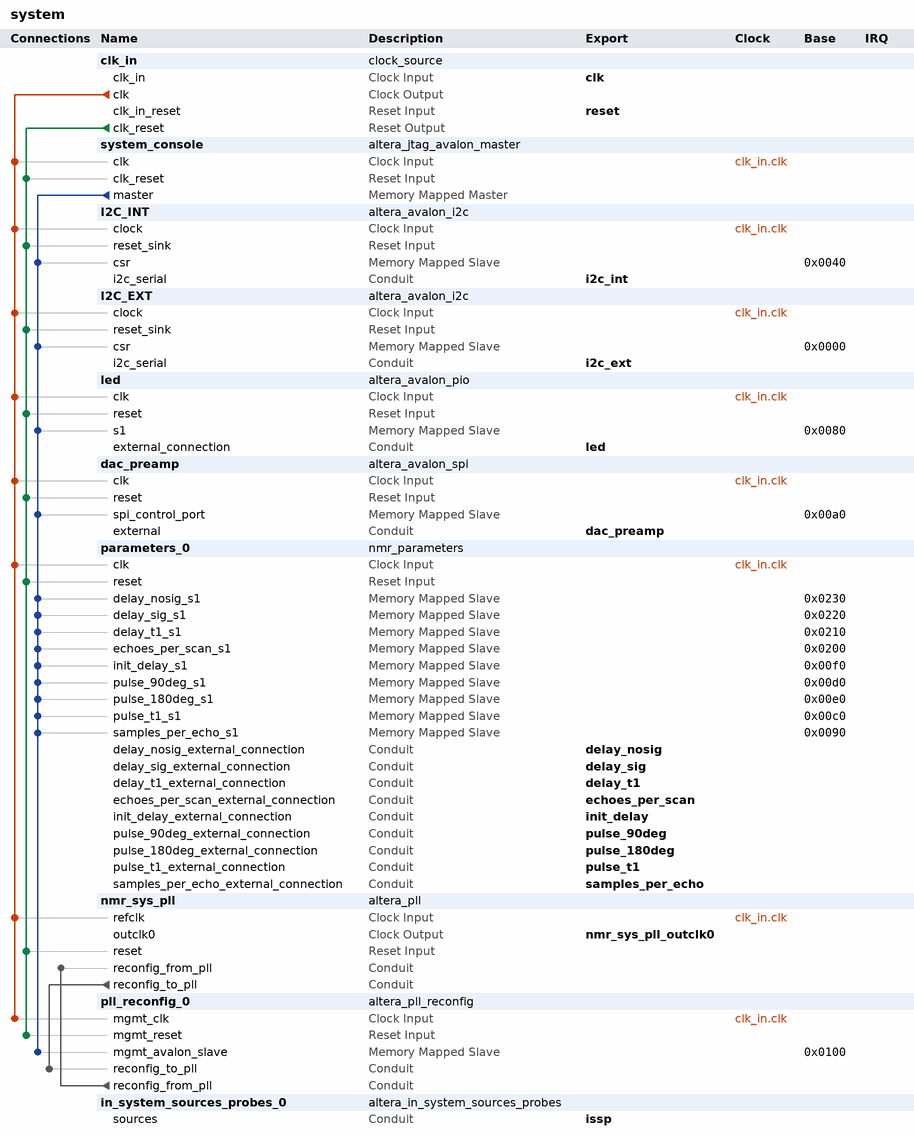
[diagram p0: system contents]
# Platform Designer (Qsys) system system, Cyclone V 5CSEMA5F31C6
# Parameters at their usual value, and those the tool derives, are not listed.
package require -exact qsys 17.1
create_system system
set_project_property DEVICE_FAMILY {Cyclone V}
set_project_property DEVICE 5CSEMA5F31C6

add_instance clk_in clock_source 17.1
set_instance_parameter_value clk_in clockFrequency 50000000

add_instance system_console altera_jtag_avalon_master 17.1

add_instance I2C_INT altera_avalon_i2c 17.1
set_instance_parameter_value I2C_INT FIFO_DEPTH 16

add_instance I2C_EXT altera_avalon_i2c 17.1
set_instance_parameter_value I2C_EXT FIFO_DEPTH 16

add_instance led altera_avalon_pio 17.1
set_instance_parameter_value led direction Output
set_instance_parameter_value led width 10

add_instance dac_preamp altera_avalon_spi 17.1
set_instance_parameter_value dac_preamp clockPolarity 1
set_instance_parameter_value dac_preamp dataWidth 24
set_instance_parameter_value dac_preamp masterSPI true
set_instance_parameter_value dac_preamp numberOfSlaves 1
set_instance_parameter_value dac_preamp targetClockRate 128000

add_instance parameters_0 nmr_parameters 1.0

add_instance nmr_sys_pll altera_pll 17.1
set_instance_parameter_value nmr_sys_pll gui_device_speed_grade 1
set_instance_parameter_value nmr_sys_pll gui_en_reconf true
set_instance_parameter_value nmr_sys_pll gui_number_of_clocks 1
set_instance_parameter_value nmr_sys_pll gui_operation_mode direct
set_instance_parameter_value nmr_sys_pll gui_output_clock_frequency0 68.8
set_instance_parameter_value nmr_sys_pll gui_pll_mode {Fractional-N PLL}
set_instance_parameter_value nmr_sys_pll gui_reference_clock_frequency 50.0
set_instance_parameter_value nmr_sys_pll gui_use_locked false

add_instance pll_reconfig_0 altera_pll_reconfig 17.1

add_instance in_system_sources_probes_0 altera_in_system_sources_probes 17.1
set_instance_parameter_value in_system_sources_probes_0 create_source_clock false
set_instance_parameter_value in_system_sources_probes_0 instance_id NONE
set_instance_parameter_value in_system_sources_probes_0 probe_width 0
set_instance_parameter_value in_system_sources_probes_0 source_width 1

# connections
add_connection clk_in.clk dac_preamp.clk clock
add_connection clk_in.clk I2C_EXT.clock clock
add_connection clk_in.clk I2C_INT.clock clock
add_connection clk_in.clk led.clk clock
add_connection clk_in.clk nmr_sys_pll.refclk clock
add_connection clk_in.clk parameters_0.clk clock
add_connection clk_in.clk pll_reconfig_0.mgmt_clk clock
add_connection clk_in.clk system_console.clk clock
add_connection clk_in.clk_reset dac_preamp.reset reset
add_connection clk_in.clk_reset I2C_EXT.reset_sink reset
add_connection clk_in.clk_reset I2C_INT.reset_sink reset
add_connection clk_in.clk_reset led.reset reset
add_connection clk_in.clk_reset nmr_sys_pll.reset reset
add_connection clk_in.clk_reset parameters_0.reset reset
add_connection clk_in.clk_reset pll_reconfig_0.mgmt_reset reset
add_connection clk_in.clk_reset system_console.clk_reset reset
add_connection system_console.master dac_preamp.spi_control_port avalon
set_connection_parameter_value system_console.master/dac_preamp.spi_control_port baseAddress 0x00a0
add_connection system_console.master I2C_EXT.csr avalon
set_connection_parameter_value system_console.master/I2C_EXT.csr baseAddress 0x0000
add_connection system_console.master I2C_INT.csr avalon
set_connection_parameter_value system_console.master/I2C_INT.csr baseAddress 0x0040
add_connection system_console.master led.s1 avalon
set_connection_parameter_value system_console.master/led.s1 baseAddress 0x0080
add_connection system_console.master parameters_0.delay_nosig_s1 avalon
set_connection_parameter_value system_console.master/parameters_0.delay_nosig_s1 baseAddress 0x0230
add_connection system_console.master parameters_0.delay_sig_s1 avalon
set_connection_parameter_value system_console.master/parameters_0.delay_sig_s1 baseAddress 0x0220
add_connection system_console.master parameters_0.delay_t1_s1 avalon
set_connection_parameter_value system_console.master/parameters_0.delay_t1_s1 baseAddress 0x0210
add_connection system_console.master parameters_0.echoes_per_scan_s1 avalon
set_connection_parameter_value system_console.master/parameters_0.echoes_per_scan_s1 baseAddress 0x0200
add_connection system_console.master parameters_0.init_delay_s1 avalon
set_connection_parameter_value system_console.master/parameters_0.init_delay_s1 baseAddress 0x00f0
add_connection system_console.master parameters_0.pulse_90deg_s1 avalon
set_connection_parameter_value system_console.master/parameters_0.pulse_90deg_s1 baseAddress 0x00d0
add_connection system_console.master parameters_0.pulse_180deg_s1 avalon
set_connection_parameter_value system_console.master/parameters_0.pulse_180deg_s1 baseAddress 0x00e0
add_connection system_console.master parameters_0.pulse_t1_s1 avalon
set_connection_parameter_value system_console.master/parameters_0.pulse_t1_s1 baseAddress 0x00c0
add_connection system_console.master parameters_0.samples_per_echo_s1 avalon
set_connection_parameter_value system_console.master/parameters_0.samples_per_echo_s1 baseAddress 0x0090
add_connection system_console.master pll_reconfig_0.mgmt_avalon_slave avalon
set_connection_parameter_value system_console.master/pll_reconfig_0.mgmt_avalon_slave baseAddress 0x0100
add_connection nmr_sys_pll.reconfig_to_pll pll_reconfig_0.reconfig_to_pll conduit
add_connection pll_reconfig_0.reconfig_from_pll nmr_sys_pll.reconfig_from_pll conduit

# exported interfaces
add_interface clk clock sink
set_interface_property clk EXPORT_OF clk_in.clk_in
add_interface dac_preamp conduit end
set_interface_property dac_preamp EXPORT_OF dac_preamp.external
add_interface delay_nosig conduit end
set_interface_property delay_nosig EXPORT_OF parameters_0.delay_nosig_external_connection
add_interface delay_sig conduit end
set_interface_property delay_sig EXPORT_OF parameters_0.delay_sig_external_connection
add_interface delay_t1 conduit end
set_interface_property delay_t1 EXPORT_OF parameters_0.delay_t1_external_connection
add_interface echoes_per_scan conduit end
set_interface_property echoes_per_scan EXPORT_OF parameters_0.echoes_per_scan_external_connection
add_interface i2c_ext conduit end
set_interface_property i2c_ext EXPORT_OF I2C_EXT.i2c_serial
add_interface i2c_int conduit end
set_interface_property i2c_int EXPORT_OF I2C_INT.i2c_serial
add_interface init_delay conduit end
set_interface_property init_delay EXPORT_OF parameters_0.init_delay_external_connection
add_interface issp conduit end
set_interface_property issp EXPORT_OF in_system_sources_probes_0.sources
add_interface led conduit end
set_interface_property led EXPORT_OF led.external_connection
add_interface nmr_sys_pll_outclk0 clock source
set_interface_property nmr_sys_pll_outclk0 EXPORT_OF nmr_sys_pll.outclk0
add_interface pulse_180deg conduit end
set_interface_property pulse_180deg EXPORT_OF parameters_0.pulse_180deg_external_connection
add_interface pulse_90deg conduit end
set_interface_property pulse_90deg EXPORT_OF parameters_0.pulse_90deg_external_connection
add_interface pulse_t1 conduit end
set_interface_property pulse_t1 EXPORT_OF parameters_0.pulse_t1_external_connection
add_interface reset reset sink
set_interface_property reset EXPORT_OF clk_in.clk_in_reset
add_interface samples_per_echo conduit end
set_interface_property samples_per_echo EXPORT_OF parameters_0.samples_per_echo_external_connection

set_interconnect_requirement {$system} qsys_mm.clockCrossingAdapter HANDSHAKE
set_interconnect_requirement {$system} qsys_mm.enableEccProtection FALSE
set_interconnect_requirement {$system} qsys_mm.enableInstrumentation TRUE
set_interconnect_requirement {$system} qsys_mm.insertDefaultSlave FALSE
set_interconnect_requirement {$system} qsys_mm.maxAdditionalLatency 1
set_interconnect_requirement I2C_EXT.csr qsys_mm.insertPerformanceMonitor TRUE
set_interconnect_requirement I2C_INT.csr qsys_mm.insertPerformanceMonitor TRUE
set_interconnect_requirement led.s1 qsys_mm.insertPerformanceMonitor TRUE
set_interconnect_requirement system_console.master qsys_mm.insertPerformanceMonitor TRUE

save_system system.qsys
